# Altium schematic sheet Adapter_XDS_110.SchDoc
size 431 x 279 mm; Organization: ORGANIZATION; Address1: 207; Address2: 13399 104 Ave; Address3: Surrey BC, V3T 0C9; Address4: Canada; Revision: -; SheetNumber: 1; SheetTotal: 1; ENG_APP_DATE: --/--/--; DSN_APP_DATE: --/--/--; CHK_APP_DATE: --/--/--
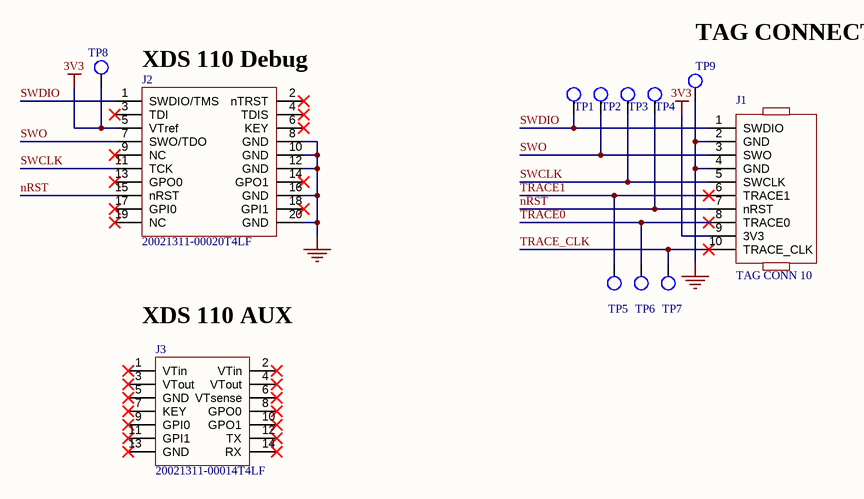
[diagram p0: Adapter_XDS_110.SchDoc]

## Parts
J1  TAG CONN 10  [CONN HDR RECPT 20 2.54 TH TAG CONNECT 10]
J2  20021311-00020T4LF  [CONN HDR PLUG 20 1.27 TH XDS110 DEBUG]
J3  20021311-00014T4LF  [CONN HDR PLUG 14 1.27 TH XDS110 AUX]
TP1  1mm  [TESTPOINT_SMT]  (value not drawn)
TP2  1mm  [TESTPOINT_SMT]  (value not drawn)
TP3  1mm  [TESTPOINT_SMT]  (value not drawn)
TP4  1mm  [TESTPOINT_SMT]  (value not drawn)
TP5  1mm  [TESTPOINT_SMT]  (value not drawn)
TP6  1mm  [TESTPOINT_SMT]  (value not drawn)
TP7  1mm  [TESTPOINT_SMT]  (value not drawn)
TP8  1mm  [TESTPOINT_SMT]  (value not drawn)
TP9  1mm  [TESTPOINT_SMT]  (value not drawn)

## Nets
3V3: J1.9(3V3) J2.5(VTref) TP8.1
GND: J1.2(GND) J1.4(GND) J2.8(GND) J2.10(GND) J2.12(GND) J2.16(GND) J2.20(GND) TP9.1
nRST: J1.7(nRST) J2.15(nRST) TP4.1
SWCLK: J1.5(SWCLK) J2.11(TCK) TP3.1
SWDIO: J1.1(SWDIO) J2.1(SWDIO/TMS) TP1.1
SWO: J1.3(SWO) J2.7(SWO/TDO) TP2.1
TRACE0: J1.8(TRACE0) TP6.1
TRACE1: J1.6(TRACE1) TP5.1
TRACE_CLK: J1.10(TRACE_CLK) TP7.1

Not connected (* = marked no-connect by the designer): J2 2(nTRST)* 3(TDI)* 4(TDIS)* 6(KEY)* 9(NC)* 13(GPO0)* 14(GPO1)* 17(GPI0)* 18(GPI1)* 19(NC)*; J3 1(VTin)* 2(VTin)* 3(VTout)* 4(VTout)* 5(GND)* 6(VTsense)* 7(KEY)* 8(GPO0)* 9(GPI0)* 10(GPO1)* 11(GPI1)* 12(TX)* 13(GND)* 14(RX)*

## Notes on the sheet
- XDS 110 Debug
- (near TP9) TAG CONNECT
- (near J3) XDS 110 AUX
- REV:
- PROJECT
- FaustOEM
- DESIGN ITEM:
- TITLE
- SHEET
- OF

## Library data of the parts
J1 = CONN HDR RECPT 10 2.54mm TH SWV: Conn Shrouded Header HDR 10 POS 2.54mm Solder ST Thru-Hole; Manufacturer: On-Shore Technology; Manufacturer Part Number: 302-S101; Number of Positions: 10; Connector Type: Male Pin; Pitch: 0.1inch; Supplier 1: Digi-Key; RoHS: Yes; Category: Connectors; Stock 1: 61558; Pricing 1: 1=0.29000, 10=0.24800, 100=0.19290, 500=0.16538, 1000=0.13781, 5000=0.11812, 10000=0.11025 (USD); Mount: Through Hole; Color: Black; Contact Plating: Gold; Number of Rows: 2; Packaging: Tray; Termination: Solder; Series: 302; Contact Type: Male Pin; Row Spacing: 0.1inch; ComponentLink1URL: https://datasheet.ciiva.com/732/302-sxxx-732946.pdf?src-supplier=Digi-Key; ComponentLink1Description: https://datasheet.ciiva.com/732/302-sxxx-732946.pdf?src-supplier=Digi-Key; Supplier Part Number 1: ED1543-ND
J2 = CONN HDR RECPT 20 1.27mm TH 20021311-00020T4LF: Dual Row 20 Position 1.27 mm Board to Board Through Hole Female Socket Connector; Manufacturer 1: Amphenol ICC / FCI; Category 1: Connectors; Connector Type: Receptacle; Number of Positions: 20; Current Rating: 1A; Voltage Rating: 125V; Contact Resistance: 30mR; Pitch: 1.27mm; Row Spacing: 0.05inch; Supplier 1: Newark; Supplier Part Number 1: 82R8663; Manufacturer Part Number 1: 20021311-00020T4LF; RoHS 1: Yes; Description 1: Dual Row 20 Position 1.27 mm Board to Board Through Hole Female Socket Connector; Mounting Technology: Through Hole; Contact Plating: Gold; Color: Black; Contact Material: Copper Alloy,Copper; Housing Material: Plastic; Min Operating Temperature: -40°C; Max Operating Temperature: 85°C; Series: Minitek 127® 20021311; Packaging: Rail/Tube; Contact Type: Female Socket; Number of Rows: 2; Termination: Solder; Package Quantity: 45; Number of Contacts: 20; Gender: Receptacle; Orientation: Straight; Max Voltage Rating (AC): 125V; Length: 11.43mm; Depth: 3mm; Radiation Hardening: No; Reach SVHC Compliant: Yes; ComponentLink1URL: http://www.alliedelec.com/m/d/a3245b736a91ce97db4107bcd031e553.pdf?src-supplier=Allied+Electronics; ComponentLink1Description: http://www.alliedelec.com/m/d/a3245b736a91ce97db4107bcd031e553.pdf?src-supplier=Allied+Electronics; ComponentLink2URL: https://www.verical.com/server-webapp/html/getDatasheet?partID=356979&src-supplier=Verical; ComponentLink2Description: https://www.verical.com/server-webapp/html/getDatasheet?partID=356979&src-supplier=Verical; ComponentLink3URL: http://portal.fciconnect.com/Comergent/fci/drawing/20021311.pdf?src-supplier=Avnet; ComponentLink3Description: http://portal.fciconnect.com/Comergent/fci/drawing/20021311.pdf?src-supplier=Avnet; ComponentLink4URL: http://portal.fciconnect.com/Comergent//fci/drawing/20021311.pdf?src-supplier=Mouser; ComponentLink4Description: http://portal.fciconnect.com/Comergent//fci/drawing/20021311.pdf?src-supplier=Mouser; ComponentLink5URL: http://www.farnell.com/cad/1750102.pdf?src-supplier=Element14; ComponentLink5Description: http://www.farnell.com/cad/1750102.pdf?src-supplier=Element14; ComponentLink6URL: http://components.arrow.com/part/dataview/48963304S8522655N8314?src-supplier=Arrow+Electronics; ComponentLink6Description: http://components.arrow.com/part/dataview/48963304S8522655N8314?src-supplier=Arrow+Electronics; ComponentLink7URL: http://www.farnell.com/datasheets/2374175.pdf?src-supplier=Farnell; ComponentLink7Description: http://www.farnell.com/datasheets/2374175.pdf?src-supplier=Farnell; ComponentLink8URL: https://media.digikey.com/pdf/Data%20Sheets/FCI%20PDFs/Minitek%20127_Catalog.pdf?src-supplier=Digi-Key; ComponentLink8Description: https://media.digikey.com/pdf/Data%20Sheets/FCI%20PDFs/Minitek%20127_Catalog.pdf?src-supplier=Digi-Key
J3 = CONN HDR RECPT 14 1.27mm TH 20021311-00014T4LF: 1.27mm (0.05in.) pitch, Receptacle Top entry, 14 contacts; Manufacturer 1: Amphenol ICC / FCI; Category 1: Connectors; Contact Resistance: 30mR; Current Rating: 1A; Voltage Rating: 125V; Number of Positions: 14; Gender: Female; Row Spacing: 0.05inch; Supplier 1: Newark; Supplier Part Number 1: 39AJ1937; Manufacturer Part Number 1: 20021311-00014T4LF; RoHS 1: Yes; Description 1: 1.27mm (0.05in.) pitch, Receptacle Top entry, 14 contacts; Mounting Technology: Through Hole; Contact Plating: Gold; Contact Material: Copper Alloy; Color: Black; Housing Material: Plastic; Min Operating Temperature: -40°C; Max Operating Temperature: 85°C; Package Quantity: 63; Number of Rows: 2; Packaging: Rail/Tube; Connector Type: Receptacle; Termination: Solder; Max Voltage Rating (AC): 125V; Number of Contacts: 14; Orientation: Straight; Series: Minitek 127® 20021311; Contact Type: Female Socket; Length: 7.62mm; Pitch: 1.27mm; Depth: 3mm; RoHS Compliant: Yes; ComponentLink1URL: https://datasheet.ciiva.com/411/20021311-411141.pdf?src-supplier=Digi-Key; ComponentLink1Description: https://datasheet.ciiva.com/411/20021311-411141.pdf?src-supplier=Digi-Key; ComponentLink2URL: https://datasheet.ciiva.com/13874/20021311-13874918.pdf?src-supplier=Mouser; ComponentLink2Description: https://datasheet.ciiva.com/13874/20021311-13874918.pdf?src-supplier=Mouser; ComponentLink3URL: https://datasheet.ciiva.com/10135/20021311-10135351.pdf?src-supplier=Avnet; ComponentLink3Description: https://datasheet.ciiva.com/10135/20021311-10135351.pdf?src-supplier=Avnet
TP1-TP9 = TP 1mm: SMT testpoint